# EAGLE schematic picostepknobs_dispoffset (EAGLE 9.6.2)
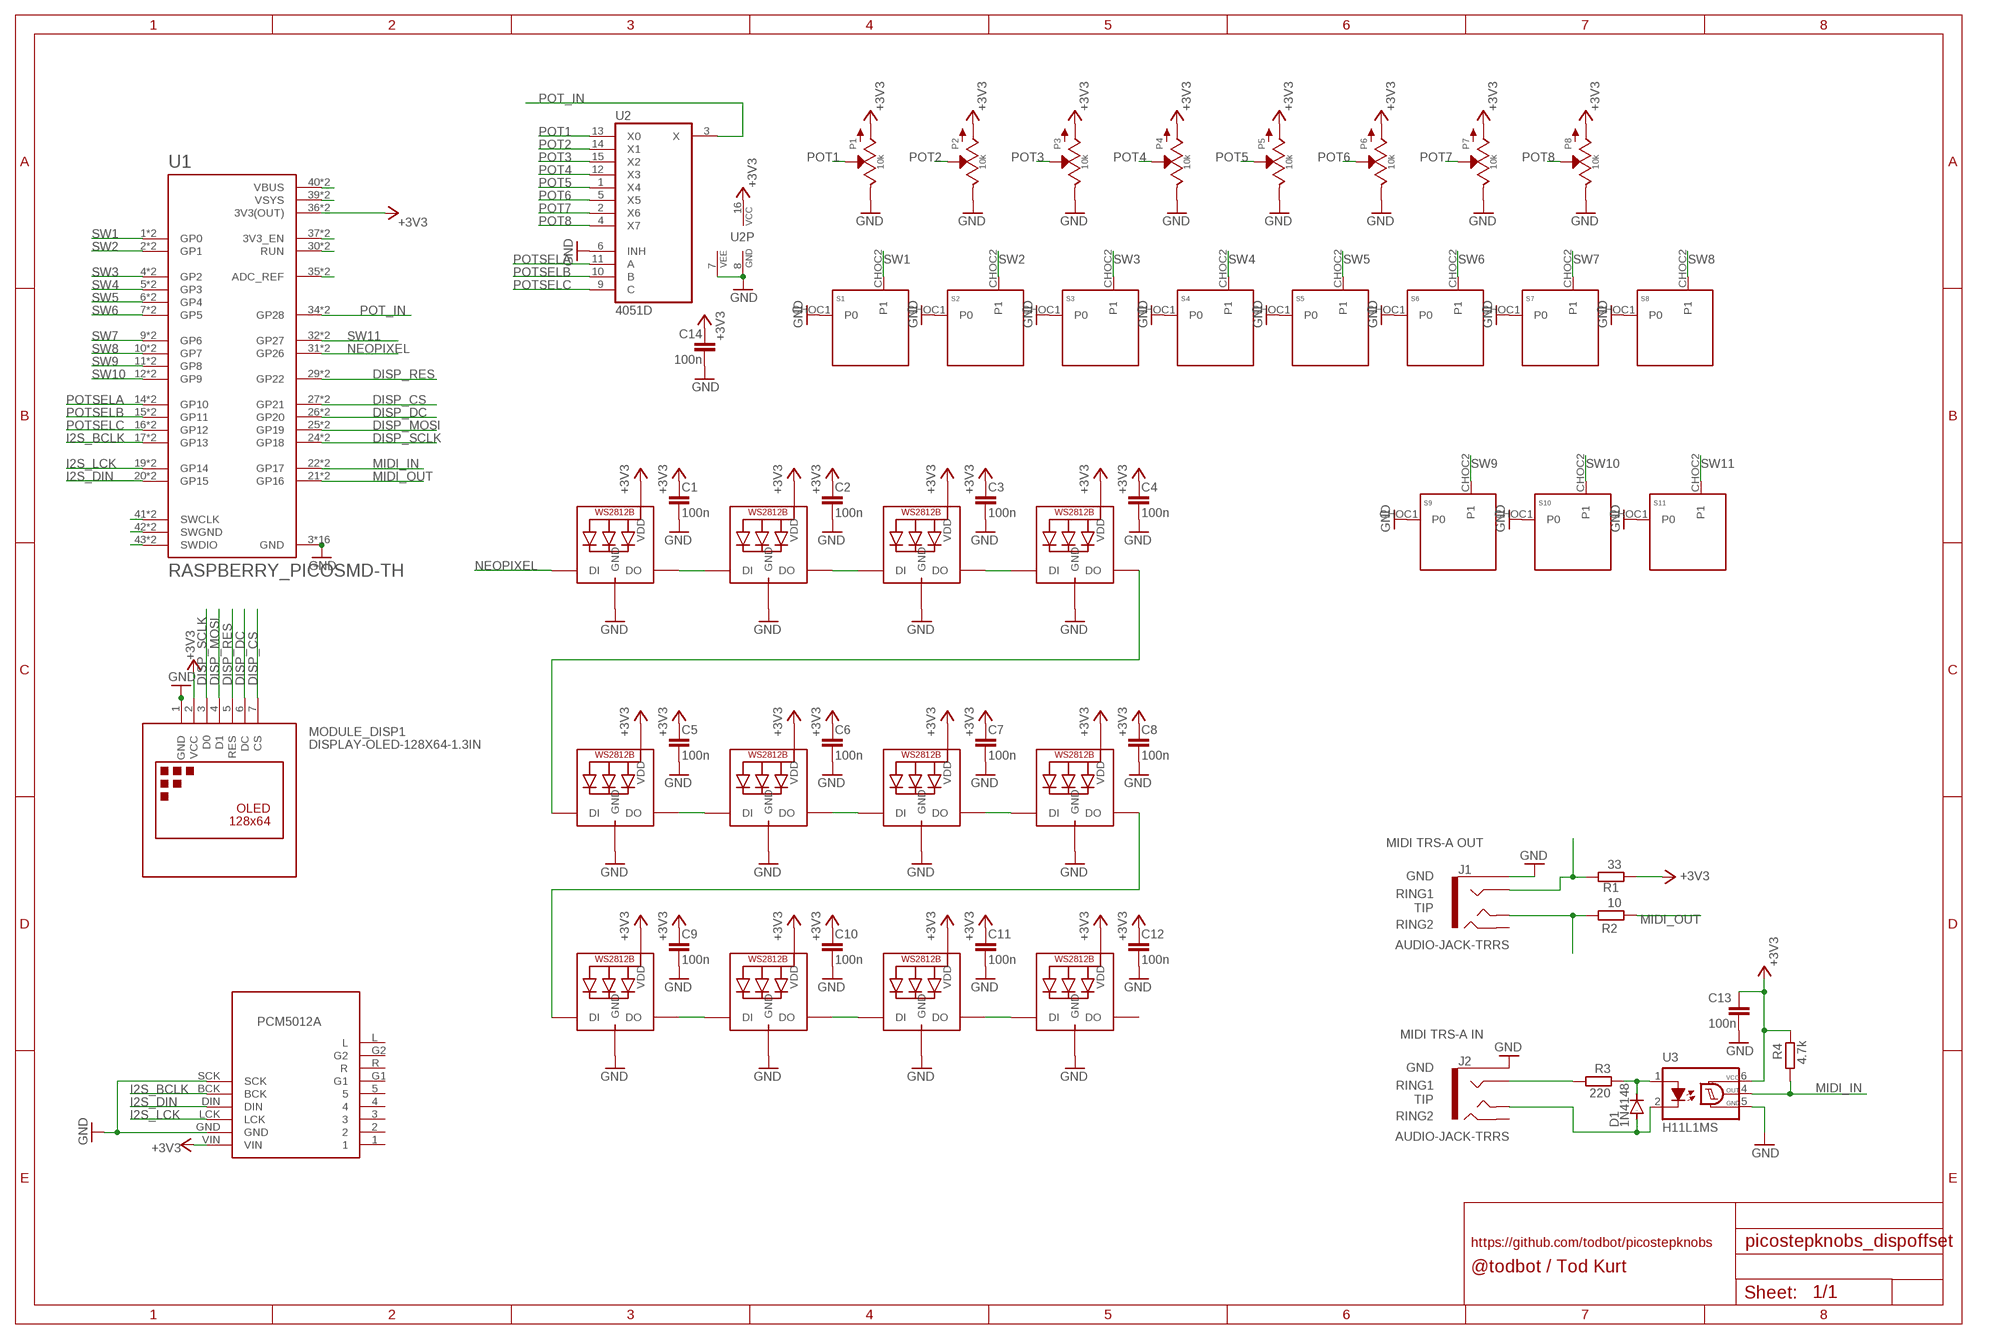
[diagram p0: schematic, sheet 1]

## Parts
C1  100n  C-EUC0805  [C0805]
C2  100n  C-EUC0805  [C0805]
C3  100n  C-EUC0805  [C0805]
C4  100n  C-EUC0805  [C0805]
C5  100n  C-EUC0805  [C0805]
C6  100n  C-EUC0805  [C0805]
C7  100n  C-EUC0805  [C0805]
C8  100n  C-EUC0805  [C0805]
C9  100n  C-EUC0805  [C0805]
C10  100n  C-EUC0805  [C0805]
C11  100n  C-EUC0805  [C0805]
C12  100n  C-EUC0805  [C0805]
C13  100n  C-EUC0805  [C0805]
C14  100n  C-EUC0805  [C0805]
D1  1N4148  DIODE-SOD123  [SOD123]
J1  AUDIO-JACK-TRRS  [PJ-320D_SPARKFUN]
J2  AUDIO-JACK-TRRS  [PJ-320D_SPARKFUN]
LED1  WS2812B3535  [LED3535]
LED2  WS2812B3535  [LED3535]
LED3  WS2812B3535  [LED3535]
LED4  WS2812B3535  [LED3535]
LED5  WS2812B3535  [LED3535]
LED6  WS2812B3535  [LED3535]
LED7  WS2812B3535  [LED3535]
LED8  WS2812B3535  [LED3535]
LED9  WS2812B3535  [LED3535]
LED10  WS2812B3535  [LED3535]
LED11  WS2812B3535  [LED3535]
LED12  WS2812B3535  [LED3535]
MODULE_DISP1  DISPLAY-OLED-128X64-1.3IN  [DISPLAY-OLED-128X64-1.3IN]
MODULE_PCM5102A  I2S_PCM_51XX_SOUNDCARD  [I2S_PCM_5100_SOUNDCARD]
P1  10k  POTZEPHPOT_BIGKNOB  [OG-POTS_ALPS_POT_VERTICAL_WITHBIGKNOB]
P2  10k  POTZEPHPOT_BIGKNOB  [OG-POTS_ALPS_POT_VERTICAL_WITHBIGKNOB]
P3  10k  POTZEPHPOT_BIGKNOB  [OG-POTS_ALPS_POT_VERTICAL_WITHBIGKNOB]
P4  10k  POTZEPHPOT_BIGKNOB  [OG-POTS_ALPS_POT_VERTICAL_WITHBIGKNOB]
P5  10k  POTZEPHPOT_BIGKNOB  [OG-POTS_ALPS_POT_VERTICAL_WITHBIGKNOB]
P6  10k  POTZEPHPOT_BIGKNOB  [OG-POTS_ALPS_POT_VERTICAL_WITHBIGKNOB]
P7  10k  POTZEPHPOT_BIGKNOB  [OG-POTS_ALPS_POT_VERTICAL_WITHBIGKNOB]
P8  10k  POTZEPHPOT_BIGKNOB  [OG-POTS_ALPS_POT_VERTICAL_WITHBIGKNOB]
R1  33  R-EU_R0805  [R0805]
R2  10  R-EU_R0805  [R0805]
R3  220  R-EU_R0805  [R0805]
R4  4.7k  R-EU_R0805  [R0805]
S1  KEYSWITCH-PLAIN-CHOC-1U  [CHOC-1U]
S2  KEYSWITCH-PLAIN-CHOC-1U  [CHOC-1U]
S3  KEYSWITCH-PLAIN-CHOC-1U  [CHOC-1U]
S4  KEYSWITCH-PLAIN-CHOC-1U  [CHOC-1U]
S5  KEYSWITCH-PLAIN-CHOC-1U  [CHOC-1U]
S6  KEYSWITCH-PLAIN-CHOC-1U  [CHOC-1U]
S7  KEYSWITCH-PLAIN-CHOC-1U  [CHOC-1U]
S8  KEYSWITCH-PLAIN-CHOC-1U  [CHOC-1U]
S9  KEYSWITCH-PLAIN-CHOC-1U  [CHOC-1U]
S10  KEYSWITCH-PLAIN-CHOC-1U  [CHOC-1U]
S11  KEYSWITCH-PLAIN-CHOC-1U  [CHOC-1U]
U1  RASPBERRY_PICOSMD-TH  [PICO-PKG]
U2  4051D  [SO16]
U3  H11L1MS  [DIL6-SMD]

## Nets
+3V3: C1.1 C2.1 C3.1 C4.1 C5.1 C6.1 C7.1 C8.1 C9.1 C10.1 C11.1 C12.1 C13.1 C14.1 LED1.2(VDD) LED2.2(VDD) LED3.2(VDD) LED4.2(VDD) LED5.2(VDD) LED6.2(VDD) LED7.2(VDD) LED8.2(VDD) LED9.2(VDD) LED10.2(VDD) LED11.2(VDD) LED12.2(VDD) MODULE_DISP1.2(VCC) MODULE_PCM5102A.VIN P1.P$3(A) P2.P$3(A) P3.P$3(A) P4.P$3(A) P5.P$3(A) P6.P$3(A) P7.P$3(A) P8.P$3(A) R1.2 R4.1 U1.36(3V3(OUT)) U1.P$36(3V3(OUT)) U2.16(VCC) U3.6(VCC)
DISP_CS: MODULE_DISP1.7(CS) U1.27(GP21) U1.P$27(GP21)
DISP_DC: MODULE_DISP1.6(DC) U1.26(GP20) U1.P$26(GP20)
DISP_MOSI: MODULE_DISP1.4(D1) U1.25(GP19) U1.P$25(GP19)
DISP_RES: MODULE_DISP1.5(RES) U1.29(GP22) U1.P$29(GP22)
DISP_SCLK: MODULE_DISP1.3(D0) U1.24(GP18) U1.P$24(GP18)
GND: C1.2 C2.2 C3.2 C4.2 C5.2 C6.2 C7.2 C8.2 C9.2 C10.2 C11.2 C12.2 C13.2 C14.2 J1.EARTH J2.EARTH LED1.4(GND) LED2.4(GND) LED3.4(GND) LED4.4(GND) LED5.4(GND) LED6.4(GND) LED7.4(GND) LED8.4(GND) LED9.4(GND) LED10.4(GND) LED11.4(GND) LED12.4(GND) MODULE_DISP1.1(GND) MODULE_PCM5102A.GND MODULE_PCM5102A.SCK P1.P$1(E) P2.P$1(E) P3.P$1(E) P4.P$1(E) P5.P$1(E) P6.P$1(E) P7.P$1(E) P8.P$1(E) S1.CHOC1(P0) S2.CHOC1(P0) S3.CHOC1(P0) S4.CHOC1(P0) S5.CHOC1(P0) S6.CHOC1(P0) S7.CHOC1(P0) S8.CHOC1(P0) S9.CHOC1(P0) S10.CHOC1(P0) S11.CHOC1(P0) U1.3(GND) U1.8(GND) U1.13(GND) U1.18(GND) U1.23(GND) U1.28(GND) U1.33(GND) U1.38(GND) U1.P$3(GND) U1.P$8(GND) U1.P$13(GND) U1.P$18(GND) U1.P$23(GND) U1.P$28(GND) U1.P$33(GND) U1.P$38(GND) U2.6(INH) U2.7(VEE) U2.8(GND) U3.5(GND)
I2S_BCLK: MODULE_PCM5102A.BCK U1.17(GP13) U1.P$17(GP13)
I2S_DIN: MODULE_PCM5102A.DIN U1.20(GP15) U1.P$20(GP15)
I2S_LCK: MODULE_PCM5102A.LCK U1.19(GP14) U1.P$19(GP14)
MIDI_IN: R4.2 U1.22(GP17) U1.P$22(GP17) U3.4(OUT)
MIDI_OUT: R2.2 U1.21(GP16) U1.P$21(GP16)
N$1: LED1.3(DO) LED2.1(DI)
N$2: LED2.3(DO) LED3.1(DI)
N$3: U1.37(3V3_EN) U1.P$37(3V3_EN)
N$4: LED3.3(DO) LED4.1(DI)
N$5: U1.30(RUN) U1.P$30(RUN)
N$6: U1.35(ADC_REF) U1.P$35(ADC_REF)
N$7: U1.40(VBUS) U1.P$40(VBUS)
N$8: U1.39(VSYS) U1.P$39(VSYS)
N$9: J1.TIP R2.1
N$10: LED4.3(DO) LED5.1(DI)
N$11: LED5.3(DO) LED6.1(DI)
N$12: LED6.3(DO) LED7.1(DI)
N$13: LED7.3(DO) LED8.1(DI)
N$14: LED9.3(DO) LED10.1(DI)
N$15: LED10.3(DO) LED11.1(DI)
N$16: LED11.3(DO) LED12.1(DI)
N$17: LED8.3(DO) LED9.1(DI)
N$18: U1.41(SWCLK) U1.P$41(SWCLK)
N$19: U1.42(SWGND) U1.P$42(SWGND)
N$20: U1.43(SWDIO) U1.P$43(SWDIO)
N$38: J1.RING1 R1.1
N$47: D1.C R3.1 U3.1(A)
N$48: D1.A J2.TIP U3.2(C)
N$49: J2.RING1 R3.2
NEOPIXEL: LED1.1(DI) U1.31(GP26) U1.P$31(GP26)
POT1: P1.P$2(S) U2.13(X0)
POT2: P2.P$2(S) U2.14(X1)
POT3: P3.P$2(S) U2.15(X2)
POT4: P4.P$2(S) U2.12(X3)
POT5: P5.P$2(S) U2.1(X4)
POT6: P6.P$2(S) U2.5(X5)
POT7: P7.P$2(S) U2.2(X6)
POT8: P8.P$2(S) U2.4(X7)
POT_IN: U1.34(GP28) U1.P$34(GP28) U2.3(X)
POTSELA: U1.14(GP10) U1.P$14(GP10) U2.11(A)
POTSELB: U1.15(GP11) U1.P$15(GP11) U2.10(B)
POTSELC: U1.16(GP12) U1.P$16(GP12) U2.9(C)
SW1: S1.CHOC2(P1) U1.1(GP0) U1.P$1(GP0)
SW2: S2.CHOC2(P1) U1.2(GP1) U1.P$2(GP1)
SW3: S3.CHOC2(P1) U1.4(GP2) U1.P$4(GP2)
SW4: S4.CHOC2(P1) U1.5(GP3) U1.P$5(GP3)
SW5: S5.CHOC2(P1) U1.6(GP4) U1.P$6(GP4)
SW6: S6.CHOC2(P1) U1.7(GP5) U1.P$7(GP5)
SW7: S7.CHOC2(P1) U1.9(GP6) U1.P$9(GP6)
SW8: S8.CHOC2(P1) U1.10(GP7) U1.P$10(GP7)
SW9: S9.CHOC2(P1) U1.11(GP8) U1.P$11(GP8)
SW10: S10.CHOC2(P1) U1.12(GP9) U1.P$12(GP9)
SW11: S11.CHOC2(P1) U1.32(GP27) U1.P$32(GP27)
Unconnected: J1.RING2 J2.RING2 LED12.3(DO) MODULE_PCM5102A.1 MODULE_PCM5102A.2 MODULE_PCM5102A.3 MODULE_PCM5102A.4 MODULE_PCM5102A.5 MODULE_PCM5102A.G1 MODULE_PCM5102A.G2 MODULE_PCM5102A.L MODULE_PCM5102A.R

## Notes on the sheet
- MIDI TRS-A OUT
- GND
- RING1
- TIP
- RING2
- PCM5012A
- MIDI TRS-A IN
- GND
- RING1
- TIP
- RING2
- https://github.com/todbot/picostepknobs
- @todbot / Tod Kurt

## Library data of the parts
C1-C14 = rcl:C-EU: CAPACITOR, European symbol; SPICEPREFIX: C
D1 = diode:DIODE-: DIODE
J1 J2 = audio_jacks_todbot:AUDIO-JACK-TRRS; LCSC: C431535; MPN: PJ-320D
LED1-LED12 = todstuff2023:WS2812B
MODULE_DISP1 = todstuff2023:DISPLAY-OLED-128X64: 128x64 Dot Matrix OLED Module based on SSD1306 chip or SH1106 Variant with SPI interface More details available here: http://www.instructables.com/id/How-to-use-OLED-display-arduino-module/ SSD1306 datasheet: https://cdn-shop.adafruit.com/datasheets/SSD1306.pdf SH1106 datasheet: https://cdn-shop.adafruit.com/product-files/5228/5223-ds.pdf Click here to find device on ebay.com <http://www.ebay.com/sch/oled+display+128x64> Note: There are two variants: I2C and SPI. Search for the proper version.
MODULE_PCM5102A = PCM5102A:I2S_PCM_51XX_SOUNDCARD
P1-P8 = EurorackModularParts:POT
R1-R4 = rcl:R-EU_: RESISTOR, European symbol; SPICEPREFIX: R
S1-S11 = Keyboard:KEYSWITCH-PLAIN
U1 = RpiPico:RASPBERRY_PICO: Raspberry Pi Pico
U2 = 40xx:4051: 8-channel ANALOG MULTIPLEXER
U3 = optocoupler:H11L*M: 6-Pin DIP Optocoupler Source: http://www.fairchildsemi.com/ds/H1/H11L2-M.pdf; LCSC: C78589; MPN2: H11L1S; OC_FARNELL: unknown; OC_NEWARK: unknown